# Altium project SkyWar.PrjPcb
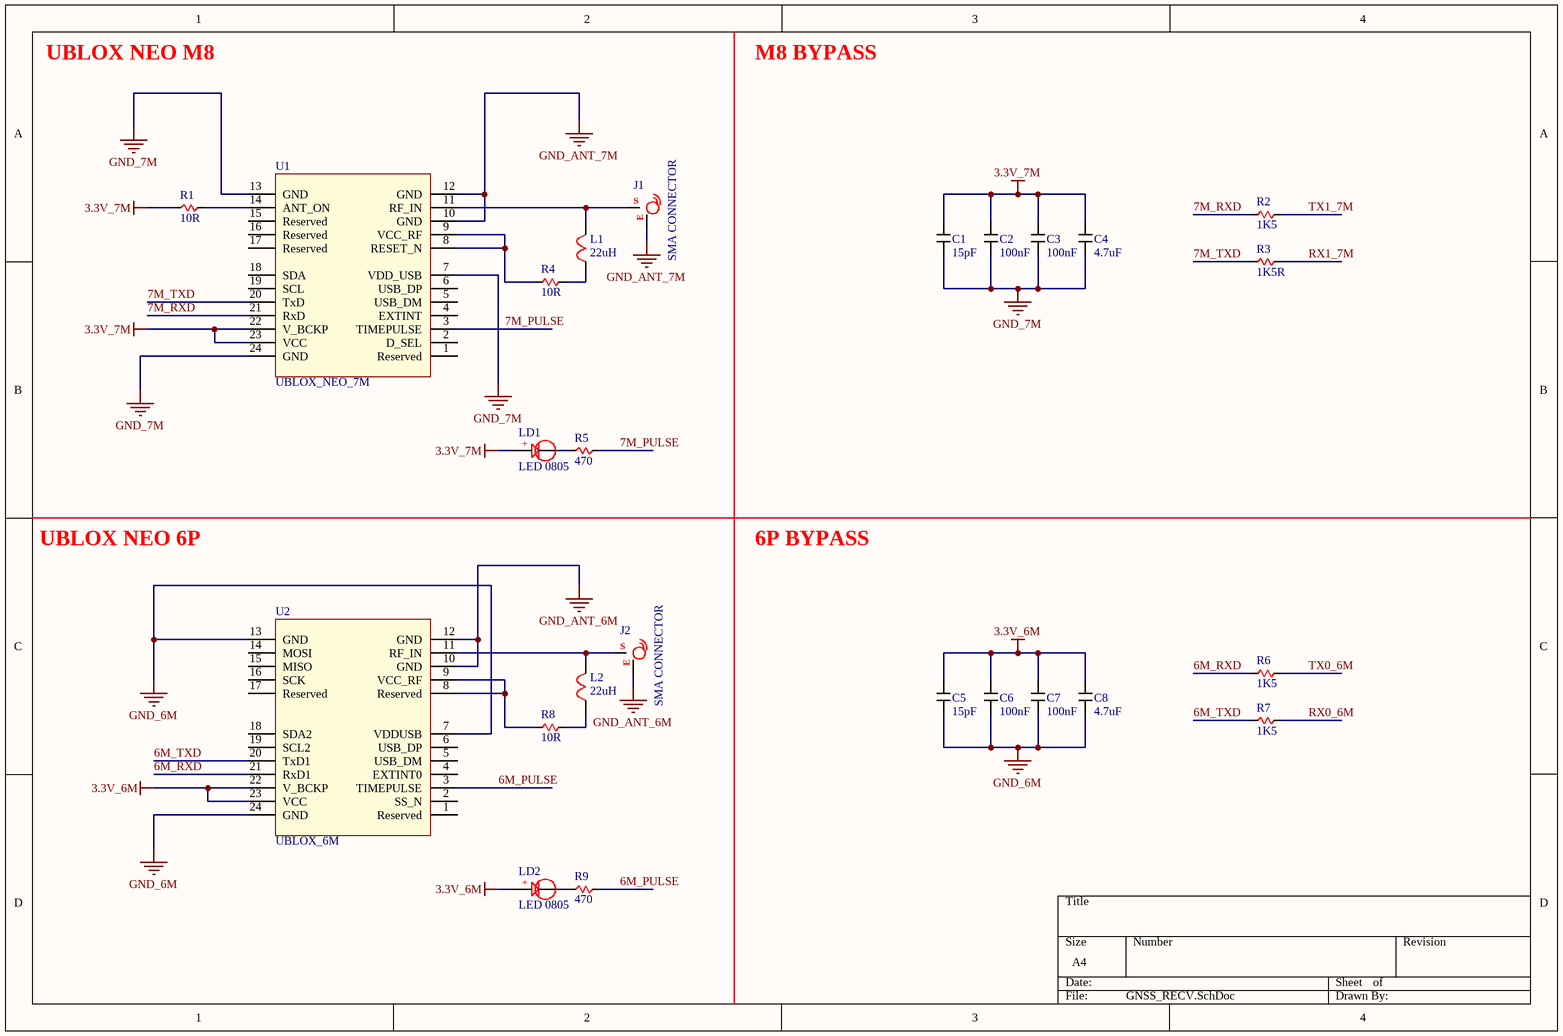
[diagram p0: GNSS_RECV.SchDoc]
4 sheets, 109 parts. Net scope: global (net labels, ports and power ports of the same name join across sheets).
Board file: SkyWar.PcbDoc
Sheets:
  GNSS_RECV.SchDoc
  MCU.SchDoc
  POWER_SUPPLIES.SchDoc
  Socket.SchDoc

## Sheet GNSS_RECV.SchDoc
size A4

### Parts
C1  15pF  [C 0805]
C2  100nF  [C 0805]
C3  100nF  [C 0805]
C4  4.7uF  [C 0805]
C5  15pF  [C 0805]
C6  100nF  [C 0805]
C7  100nF  [C 0805]
C8  4.7uF  [C 0805]
J1  SMA CONNECTOR  [SMA_CONNECTOR]
J2  SMA CONNECTOR  [SMA_CONNECTOR]
L1  22uH  [L 0603]
L2  22uH  [L 0603]
LD1  LED 0805  [LED 0805]
LD2  LED 0805  [LED 0805]
R1  10R  [R 0805]
R2  1K5  [R 0805]
R3  1K5R  [R 0805]
R4  10R  [R 0805]
R5  470  [R 0805]
R6  1K5  [R 0805]
R7  1K5  [R 0805]
R8  10R  [R 0805]
R9  470  [R 0805]
U1  UBLOX_NEO_7M  [UBLOX_M8]
U2  UBLOX_6M  [UBLOX_6P]

### Nets
3.3V_6M: C5.2 C6.2 C7.2 C8.2 LD2.1 U2.22(V_BCKP) U2.23(VCC)
3.3V_7M: C1.2 C2.2 C3.2 C4.2 LD1.1 R1.1 U1.22(V_BCKP) U1.23(VCC)
GND_6M: C5.1 C6.1 C7.1 C8.1 U2.7(VDDUSB) U2.13(GND) U2.24(GND)
GND_7M: C1.1 C2.1 C3.1 C4.1 U1.7(VDD_USB) U1.13(GND) U1.24(GND)
GND_ANT_6M: J2.2 U2.10(GND) U2.12(GND)
GND_ANT_7M: J1.2 U1.10(GND) U1.12(GND)
6M_PULSE: R9.1 U2.3(TIMEPULSE)
6M_RXD: R6.1 U2.21(RxD1)
6M_TXD: R7.1 U2.20(TxD1)
7M_PULSE: R5.1 U1.3(TIMEPULSE)
7M_RXD: R2.1 U1.21(RxD)
7M_TXD: R3.1 U1.20(TxD)
RX0_6M: R7.2
RX1_7M: R3.2
TX0_6M: R6.2
TX1_7M: R2.2
NetJ1_1: J1.1(S) L1.2 U1.11(RF_IN)
NetJ2_1: J2.1(S) L2.2 U2.11(RF_IN)
NetL1_1: L1.1 R4.2
NetL2_1: L2.1 R8.1
NetLD1_2: LD1.2 R5.2
NetLD2_2: LD2.2 R9.2
NetR1_2: R1.2 U1.14(ANT_ON)
NetR4_1: R4.1 U1.8(RESET_N) U1.9(VCC_RF)
NetR8_2: R8.2 U2.8(Reserved) U2.9(VCC_RF)

Not connected (* = marked no-connect by the designer): U1 1(Reserved) 2(D_SEL) 4(EXTINT) 5(USB_DM) 6(USB_DP) 15(Reserved) 16(Reserved) 17(Reserved) 18(SDA) 19(SCL); U2 1(Reserved) 2(SS_N) 4(EXTINT0) 5(USB_DM) 6(USB_DP) 14(MOSI) 15(MISO) 16(SCK) 17(Reserved) 18(SDA2) 19(SCL2)

### Notes on the sheet
- UBLOX NEO M8
- M8 BYPASS
- UBLOX NEO 6P
- 6P BYPASS
- (in symbol ANT_SMA) E
- (in symbol LED 0805) +

### Library data of the parts
C1-C8 = C 0805
J1 J2 = ANT_SMA
L1 L2 = L 0603
R1-R9 = R 0805
U1 = UBLOX_M8
U2 = UBLOX_6P: UBLOX_NEO_6P

## Sheet MCU.SchDoc
size A4
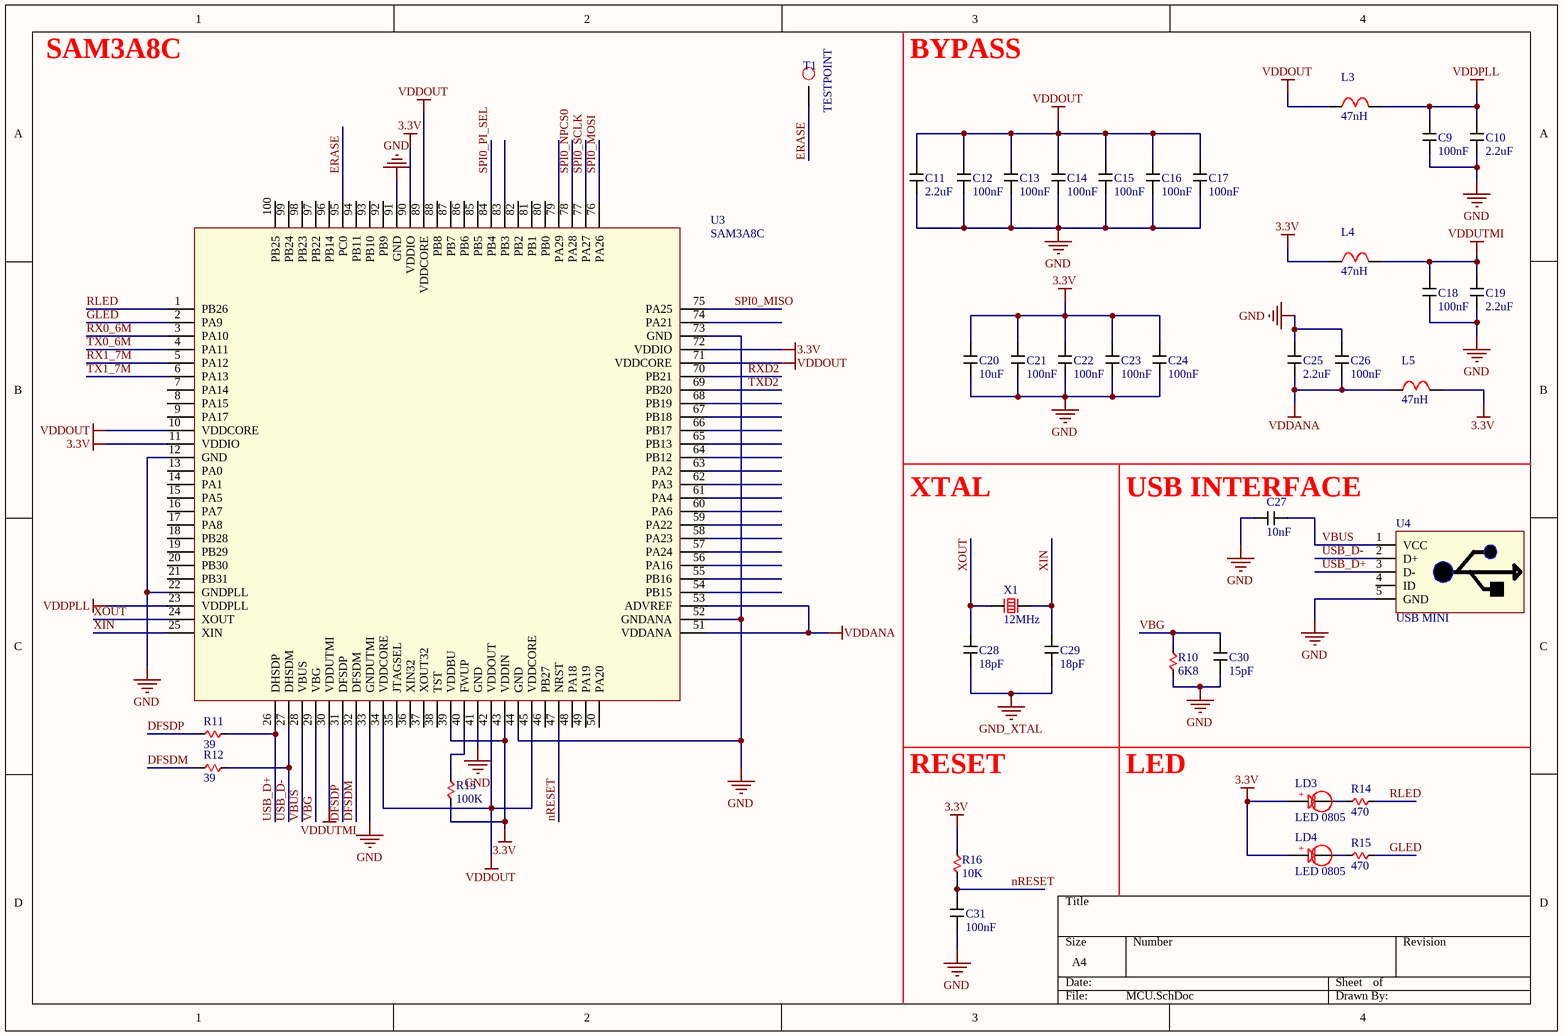
[diagram p1: MCU.SchDoc]

### Parts
C9  100nF  [C 0805]
C10  2.2uF  [C 0805]
C11  2.2uF  [C 0805]
C12  100nF  [C 0805]
C13  100nF  [C 0805]
C14  100nF  [C 0805]
C15  100nF  [C 0805]
C16  100nF  [C 0805]
C17  100nF  [C 0805]
C18  100nF  [C 0805]
C19  2.2uF  [C 0805]
C20  10uF  [C 0805]
C21  100nF  [C 0805]
C22  100nF  [C 0805]
C23  100nF  [C 0805]
C24  100nF  [C 0805]
C25  2.2uF  [C 0805]
C26  100nF  [C 0805]
C27  10nF  [C 0805]
C28  18pF  [C 0805]
C29  18pF  [C 0805]
C30  15pF  [C 0805]
C31  100nF  [C 0805]
L3  47nH  [L 0805]
L4  47nH  [L 0805]
L5  47nH  [L 0805]
LD3  LED 0805  [LED 0805]
LD4  LED 0805  [LED 0805]
R10  6K8  [R 0805]
R11  39  [R 0805]
R12  39  [R 0805]
R13  100K  [R 0805]
R14  470  [R 0805]
R15  470  [R 0805]
R16  10K  [R 0805]
T1  TESTPOINT  [TEST_POINT]
U3  SAM3A8C  [SAM3A8C]
U4  USB MINI  [USB MINI DIP]
X1  12MHz  [XTAL]

### Nets
3.3V: C20.2 C21.2 C22.2 C23.2 C24.2 L4.1 L5.1 LD3.1 LD4.1 R13.1 R16.2 U3.11(VDDIO) U3.39(VDDBU) U3.43(VDDIN) U3.72(VDDIO) U3.90(VDDIO)
GND: C9.1 C10.1 C11.1 C12.1 C13.1 C14.1 C15.1 C16.1 C17.1 C18.1 C19.1 C20.1 C21.1 C22.1 C23.1 C24.1 C25.1 C26.1 C27.2 C30.1 C31.1 R10.1 U3.12(GND) U3.22(GNDPLL) U3.33(GNDUTMI) U3.41(GND) U3.44(GND) U3.52(GNDANA) U3.73(GND) U3.91(GND) U4.5(GND)
GND_XTAL: C28.1 C29.1
VDDANA: C25.2 C26.2 L5.2 U3.51(VDDANA) U3.53(ADVREF)
VDDOUT: C11.2 C12.2 C13.2 C14.2 C15.2 C16.2 C17.2 L3.1 U3.10(VDDCORE) U3.34(VDDCORE) U3.42(VDDOUT) U3.45(VDDCORE) U3.71(VDDCORE) U3.89(VDDCORE)
VDDPLL: C9.2 C10.2 L3.2 U3.23(VDDPLL)
VDDUTMI: C18.2 C19.2 L4.2 U3.30(VDDUTMI)
DFSDM: R12.1 U3.32(DFSDM)
DFSDP: R11.1 U3.31(DFSDP)
ERASE: T1.1 U3.95(PC0)
GLED: R15.1 U3.2(PA9)
nRESET: C31.2 R16.1 U3.47(NRST)
RLED: R14.1 U3.1(PB26)
RX0_6M: U3.3(PA10)
RX1_7M: U3.5(PA12)
RXD2: U3.70(PB21)
SPI0_MISO: U3.75(PA25)
SPI0_MOSI: U3.76(PA26)
SPI0_NPCS0: U3.78(PA28)
SPI0_PI_SEL: U3.84(PB4)
SPI0_SCLK: U3.77(PA27)
TX0_6M: U3.4(PA11)
TX1_7M: U3.6(PA13)
TXD2: U3.69(PB20)
USB_D+: R11.2 U3.26(DHSDP) U4.3(D-)
USB_D-: R12.2 U3.27(DHSDM) U4.2(D+)
VBG: C30.2 R10.2 U3.29(VBG)
VBUS: C27.1 U3.28(VBUS) U4.1(VCC)
XIN: C29.2 U3.25(XIN) X1.2
XOUT: C28.2 U3.24(XOUT) X1.1
NetLD3_2: LD3.2 R14.2
NetLD4_2: LD4.2 R15.2
NetR13_2: R13.2 U3.40(FWUP)

Not connected (* = marked no-connect by the designer): U3 7(PA14) 8(PA15) 9(PA17) 13(PA0) 14(PA1) 15(PA5) 16(PA7) 17(PA8) 18(PB28) 19(PB29) 20(PB30) 21(PB31) 35(JTAGSEL) 36(XIN32) 37(XOUT32) 38(TST) 46(PB27) 48(PA18) 49(PA19) 50(PA20) 54(PB15) 55(PB16) 56(PA16) 57(PA24) 58(PA23) 59(PA22) 60(PA6) 61(PA4) 62(PA3) 63(PA2) 64(PB12) 65(PB13) 66(PB17) 67(PB18) 68(PB19) 74(PA21) 79(PA29) 80(PB0) 81(PB1) 82(PB2) 83(PB3) 85(PB5) 86(PB6) 87(PB7) 88(PB8) 92(PB9) 93(PB10) 94(PB11) 96(PB14) 97(PB22) 98(PB23) 99(PB24) 100(PB25); U4 4(ID)

### Notes on the sheet
- SAM3A8C
- BYPASS
- XTAL
- (near C27) USB INTERFACE
- RESET
- LED
- (in symbol LED 0805) +

### Library data of the parts
C9-C31 = C 0805
L3-L5 = L 0805
R10-R16 = R 0805
T1 = TEST_POINT
U4 = USB TYPE B
X1 = XTAL

## Sheet POWER_SUPPLIES.SchDoc
size A4
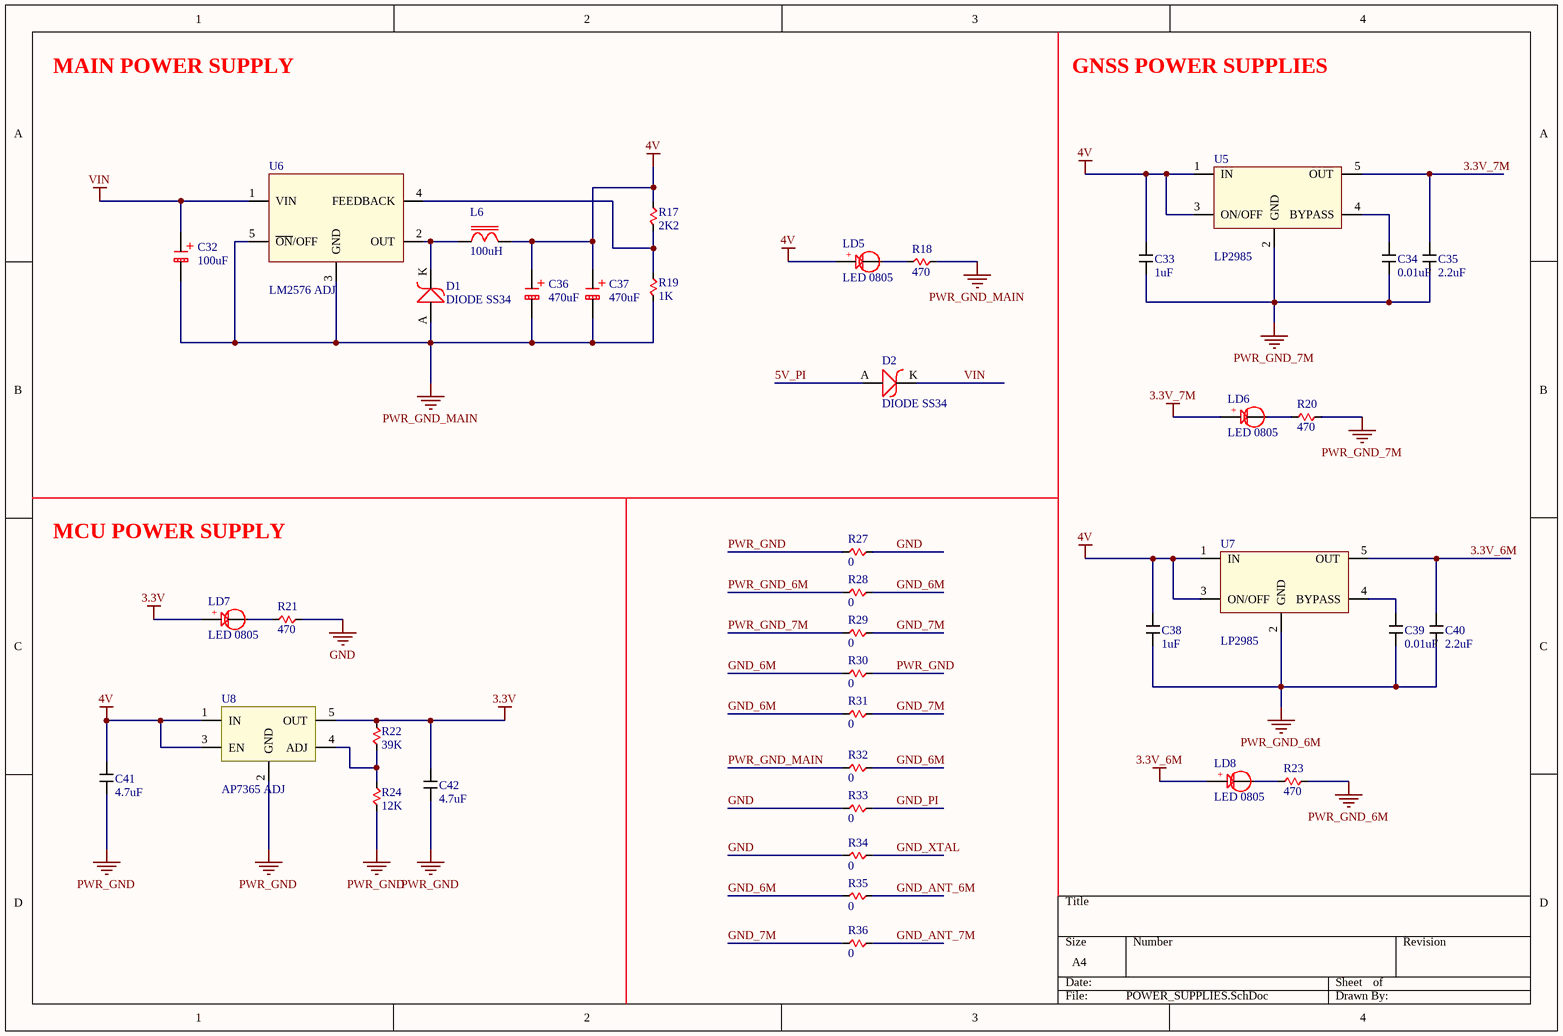
[diagram p2: POWER_SUPPLIES.SchDoc]

### Parts
C32  100uF  [C TATAL 3528]
C33  1uF  [C 0805]
C34  0.01uF  [C 0805]
C35  2.2uF  [C 0805]
C36  470uF  [C TATAL 7343]
C37  470uF  [C TATAL 7343]
C38  1uF  [C 0805]
C39  0.01uF  [C 0805]
C40  2.2uF  [C 0805]
C41  4.7uF  [C 0805]
C42  4.7uF  [C 0805]
D1  DIODE SS34  [DIODE SS34]
D2  DIODE SS34  [DIODE SS34]
L6  100uH  [L 4600]
LD5  LED 0805  [LED 0805]
LD6  LED 0805  [LED 0805]
LD7  LED 0805  [LED 0805]
LD8  LED 0805  [LED 0805]
R17  2K2  [R 0805]
R18  470  [R 0805]
R19  1K  [R 0805]
R20  470  [R 0805]
R21  470  [R 0805]
R22  39K  [R 0805]
R23  470  [R 0805]
R24  12K  [R 0805]
R27  0  [R 0805]
R28  0  [R 0805]
R29  0  [R 0805]
R30  0  [R 0805]
R31  0  [R 0805]
R32  0  [R 0805]
R33  0  [R 0805]
R34  0  [R 0805]
R35  0  [R 0805]
R36  0  [R 0805]
U5  LP2985  [LP2985]
U6  LM2576 ADJ  [LM2576 ADJ]
U7  LP2985  [LP2985]
U8  AP7365 ADJ  [AP7365 ADJ]

### Nets
3.3V: C42.1 LD7.1 R22.1 U8.5(OUT)
3.3V_6M: C40.2 LD8.1 U7.5(OUT)
3.3V_7M: C35.2 LD6.1 U5.5(OUT)
4V: C33.2 C36.1 C37.1 C38.2 C41.1 L6.2 LD5.1 R17.2 U5.1(IN) U5.3(ON/OFF) U7.1(IN) U7.3(ON/OFF) U8.1(IN) U8.3(EN)
GND: R21.1 R27.2 R33.1 R34.1
GND_6M: R28.2 R30.1 R31.1 R32.2 R35.1
GND_7M: R29.2 R31.2 R36.1
GND_ANT_6M: R35.2
GND_ANT_7M: R36.2
GND_PI: R33.2
GND_XTAL: R34.2
PWR_GND: C41.2 C42.2 R24.2 R27.1 R30.2 U8.2(GND)
PWR_GND_6M: C38.1 C39.1 C40.1 R23.1 R28.1 U7.2(GND)
PWR_GND_7M: C33.1 C34.1 C35.1 R20.1 R29.1 U5.2(GND)
PWR_GND_MAIN: C32.2 C36.2 C37.2 D1.A R18.1 R19.1 R32.1 U6.3(GND) U6.5(~{ON}/OFF)
VIN: C32.1 D2.K U6.1(VIN)
5V_PI: D2.A
NetC34_2: C34.2 U5.4(BYPASS)
NetC39_2: C39.2 U7.4(BYPASS)
NetD1_K: D1.K L6.1 U6.2(OUT)
NetLD5_2: LD5.2 R18.2
NetLD6_2: LD6.2 R20.2
NetLD7_2: LD7.2 R21.2
NetLD8_2: LD8.2 R23.2
NetR17_1: R17.1 R19.2 U6.4(FEEDBACK)
NetR22_2: R22.2 R24.1 U8.4(ADJ)

### Notes on the sheet
- MAIN POWER SUPPLY
- GNSS POWER SUPPLIES
- MCU POWER SUPPLY
- (in symbol C TATAL 3528) +
- (in symbol C TATAL 7343) +
- (in symbol LED 0805) +

### Library data of the parts
C32 = C TATAL 3528
C33-C35 C38-C42 = C 0805
C36 C37 = C TATAL 7343
L6 = L 4600
R17-R24 R27-R36 = R 0805
U5 U7 = LP2985 LDO

## Sheet Socket.SchDoc
size A
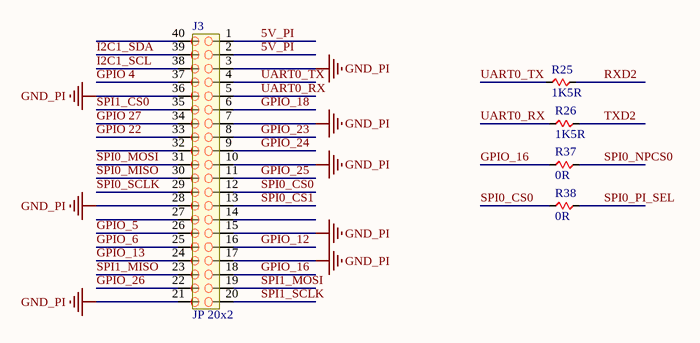
[diagram p3: Socket.SchDoc]

### Parts
J3  JP 20x2  [JP 20x2]
R25  1K5R  [R 0805]
R26  1K5R  [R 0805]
R37  0R  [R 0805]
R38  0R  [R 0805]

### Nets
GND_PI: J3.3 J3.7 J3.10 J3.15 J3.17 J3.21 J3.28 J3.36
5V_PI: J3.1 J3.2
GPIO 4: J3.37
GPIO 22: J3.33
GPIO 27: J3.34
GPIO_5: J3.26
GPIO_6: J3.25
GPIO_12: J3.16
GPIO_13: J3.24
GPIO_16: J3.18 R37.1
GPIO_18: J3.6
GPIO_23: J3.8
GPIO_24: J3.9
GPIO_25: J3.11
GPIO_26: J3.22
I2C1_SCL: J3.38
I2C1_SDA: J3.39
RXD2: R25.2
SPI0_CS0: J3.12 R38.1
SPI0_CS1: J3.13
SPI0_MISO: J3.30
SPI0_MOSI: J3.31
SPI0_NPCS0: R37.2
SPI0_PI_SEL: R38.2
SPI0_SCLK: J3.29
SPI1_CS0: J3.35
SPI1_MISO: J3.23
SPI1_MOSI: J3.19
SPI1_SCLK: J3.20
TXD2: R26.2
UART0_RX: J3.5 R26.1
UART0_TX: J3.4 R25.1

Not connected (* = marked no-connect by the designer): J3 14(19) 27(32) 32(37) 40(45)

### Library data of the parts
R25 R26 R37 R38 = R 0805

## Nets that join several sheets
3.3V: MCU (16 pins), POWER_SUPPLIES (C42.1 LD7.1 R22.1 U8.5)
3.3V_6M: GNSS_RECV (7 pins), POWER_SUPPLIES (C40.2 LD8.1 U7.5)
3.3V_7M: GNSS_RECV (8 pins), POWER_SUPPLIES (C35.2 LD6.1 U5.5)
GND: MCU (31 pins), POWER_SUPPLIES (R21.1 R27.2 R33.1 R34.1)
GND_6M: GNSS_RECV (7 pins), POWER_SUPPLIES (5 pins)
GND_7M: GNSS_RECV (7 pins), POWER_SUPPLIES (R29.2 R31.2 R36.1)
GND_ANT_6M: GNSS_RECV (J2.2 U2.10 U2.12), POWER_SUPPLIES (R35.2)
GND_ANT_7M: GNSS_RECV (J1.2 U1.10 U1.12), POWER_SUPPLIES (R36.2)
GND_PI: POWER_SUPPLIES (R33.2), Socket (8 pins)
GND_XTAL: MCU (C28.1 C29.1), POWER_SUPPLIES (R34.2)
5V_PI: POWER_SUPPLIES (D2.A), Socket (J3.1 J3.2)
RX0_6M: GNSS_RECV (R7.2), MCU (U3.3)
RX1_7M: GNSS_RECV (R3.2), MCU (U3.5)
RXD2: MCU (U3.70), Socket (R25.2)
SPI0_MISO: MCU (U3.75), Socket (J3.30)
SPI0_MOSI: MCU (U3.76), Socket (J3.31)
SPI0_NPCS0: MCU (U3.78), Socket (R37.2)
SPI0_PI_SEL: MCU (U3.84), Socket (R38.2)
SPI0_SCLK: MCU (U3.77), Socket (J3.29)
TX0_6M: GNSS_RECV (R6.2), MCU (U3.4)
TX1_7M: GNSS_RECV (R2.2), MCU (U3.6)
TXD2: MCU (U3.69), Socket (R26.2)